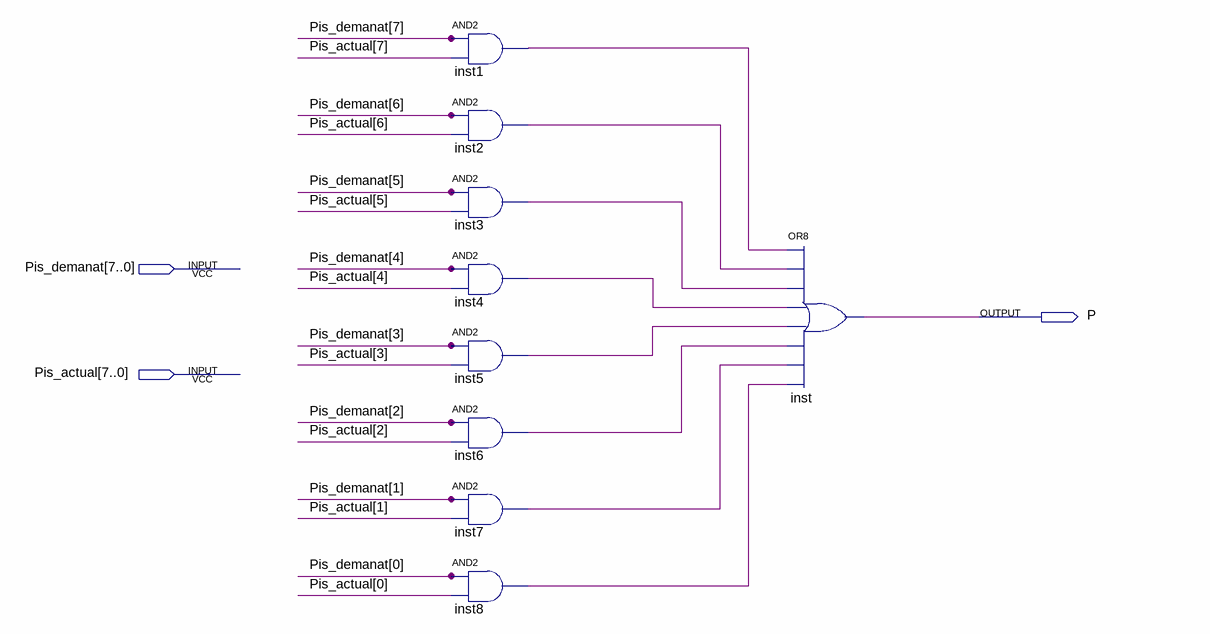
[diagram p0: schematic sheet]
// Quartus schematic Senyals_UC_P.bdf as structural Verilog: 9 symbols, 3 pins
module Senyals_UC_P (
  input  [7:0] Pis_demanat,
  input  [7:0] Pis_actual,
  output P
);

  wire inst1_out, inst2_out, inst3_out, inst4_out, inst5_out, inst6_out, inst7_out, inst8_out;

  and inst1 (inst1_out, Pis_demanat[7], Pis_actual[7]);
  and inst2 (inst2_out, Pis_demanat[6], Pis_actual[6]);
  and inst3 (inst3_out, Pis_demanat[5], Pis_actual[5]);
  and inst4 (inst4_out, Pis_demanat[4], Pis_actual[4]);
  and inst5 (inst5_out, Pis_demanat[3], Pis_actual[3]);
  and inst6 (inst6_out, Pis_demanat[2], Pis_actual[2]);
  and inst7 (inst7_out, Pis_demanat[1], Pis_actual[1]);
  and inst8 (inst8_out, Pis_demanat[0], Pis_actual[0]);
  or inst (P, inst1_out, inst2_out, inst3_out, inst4_out, inst5_out, inst6_out, inst7_out, inst8_out);
endmodule
